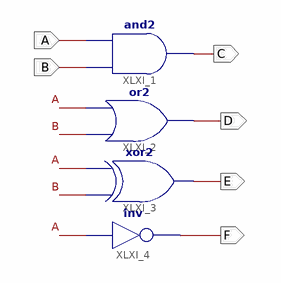
[diagram p0: schematic sheet 1]
// Xilinx ISE schematic tut.sch (spartan6) as structural Verilog: 4 symbols, 6 ports
module tut (
  input  B,
  input  A,
  output C,
  output D,
  output E,
  output F
);

  and XLXI_1 (C, B, A);
  or XLXI_2 (D, B, A);
  xor XLXI_3 (E, B, A);
  not XLXI_4 (F, A);
endmodule
